# Altium schematic sheet FPGA_BANKS.SchDoc
size A4
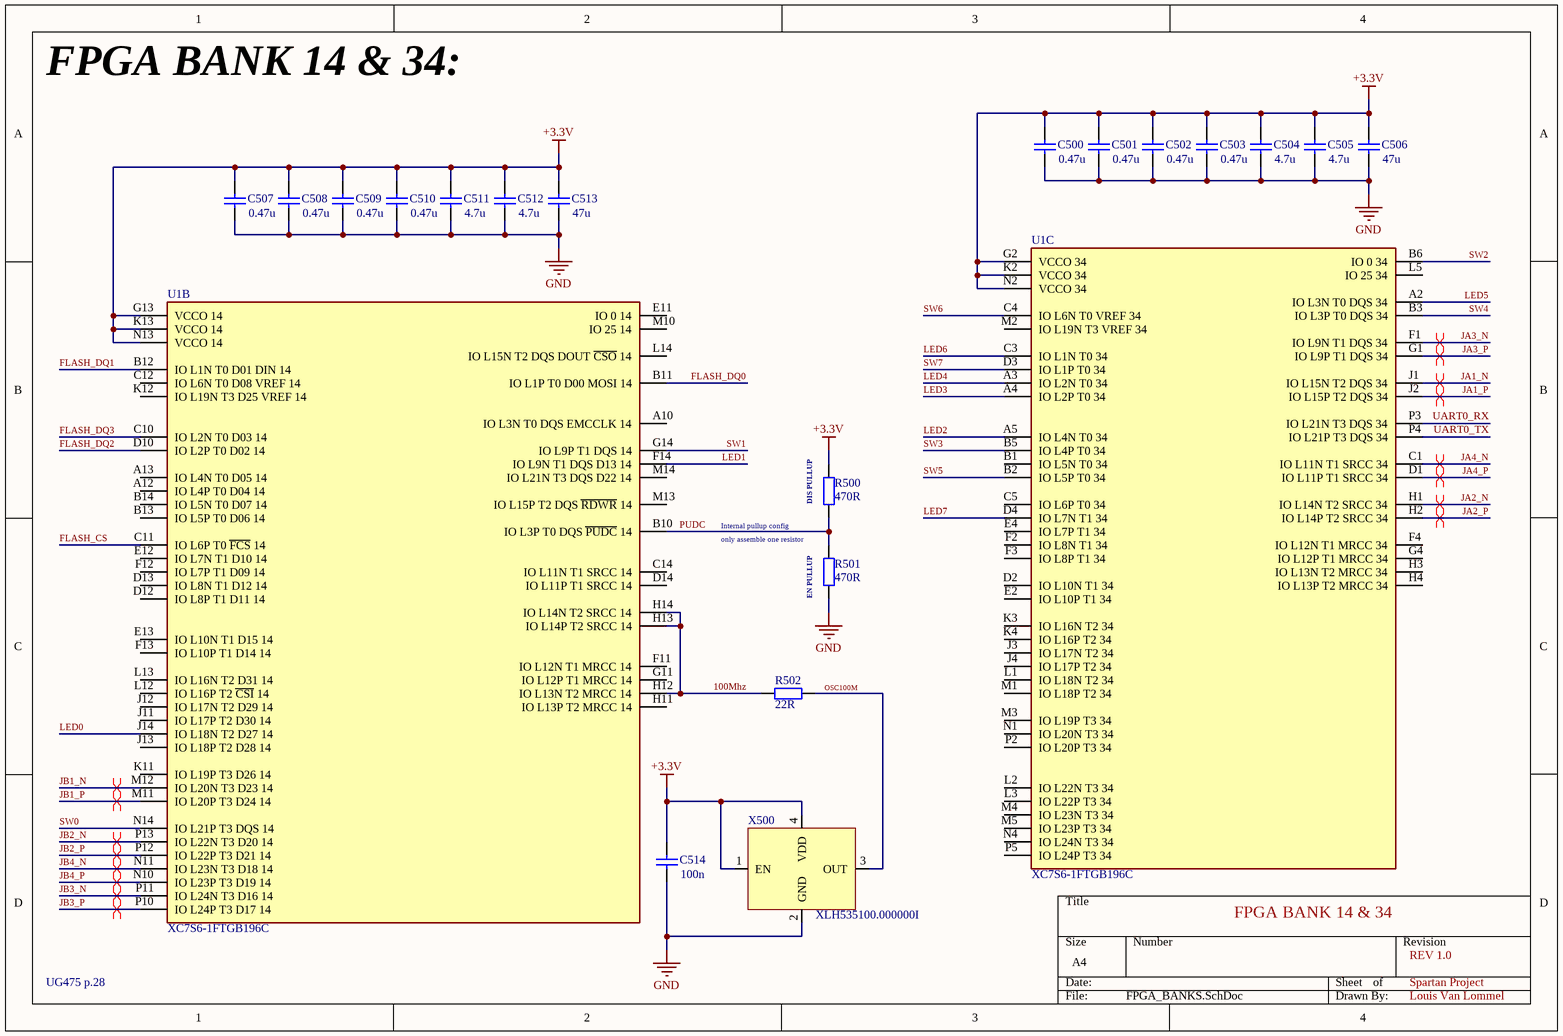
[diagram p0: FPGA_BANKS.SchDoc]

## Parts
C500  value 0.47u  [CAP_0402]  (hidden comment: 0.47uF)
C501  value 0.47u  [CAP_0402]  (hidden comment: 0.47uF)
C502  value 0.47u  [CAP_0402]  (hidden comment: 0.47uF)
C503  value 0.47u  [CAP_0402]  (hidden comment: 0.47uF)
C504  4.7u  [CAP_0402]
C505  4.7u  [CAP_0402]
C506  value 47u  [CAP_0603]  (hidden comment: 47uF)
C507  value 0.47u  [CAP_0402]  (hidden comment: 0.47uF)
C508  value 0.47u  [CAP_0402]  (hidden comment: 0.47uF)
C509  value 0.47u  [CAP_0402]  (hidden comment: 0.47uF)
C510  value 0.47u  [CAP_0402]  (hidden comment: 0.47uF)
C511  4.7u  [CAP_0402]
C512  4.7u  [CAP_0402]
C513  value 47u  [CAP_0603]  (hidden comment: 47uF)
C514  100n  [CAP_0603]
R500  value 470R  [RES_0603]  (hidden comment: 470)
R501  value 470R  [RES_0603]  (hidden comment: 470 DNP)
R502  value 22R  [RES_0603]  (hidden comment: 22)
U1  XC7S6-1FTGB196C  [FP-XC7S6-1FTGB196C-MFG]  (parts B,C of 4)
X500  XLH535100.000000I  [5X3.2MM CRYSTAL]

## Nets
+3.3V: C500.2 C501.2 C502.2 C503.2 C504.2 C505.2 C506.2 C507.2 C508.2 C509.2 C510.2 C511.2 C512.2 C513.2 C514.2 R500.2 U1.G2(VCCO_34) U1.G13(VCCO_14) U1.K2(VCCO_34) U1.K13(VCCO_14) U1.N2(VCCO_34) U1.N13(VCCO_14) X500.1(EN) X500.4(VDD)
GND: C500.1 C501.1 C502.1 C503.1 C504.1 C505.1 C506.1 C507.1 C508.1 C509.1 C510.1 C511.1 C512.1 C513.1 C514.1 R501.1 X500.2(GND)
100Mhz: R502.2 U1.H12(IO_L13N_T2_MRCC_14) U1.H13(IO_L14P_T2_SRCC_14) U1.H14(IO_L14N_T2_SRCC_14)
FLASH_CS: U1.C11(IO_L6P_T0_~{FCS}_14)
FLASH_DQ0: U1.B11(IO_L1P_T0_D00_MOSI_14)
FLASH_DQ1: U1.B12(IO_L1N_T0_D01_DIN_14)
FLASH_DQ2: U1.D10(IO_L2P_T0_D02_14)
FLASH_DQ3: U1.C10(IO_L2N_T0_D03_14)
JA1_N: U1.J1(IO_L15N_T2_DQS_34)
JA1_P: U1.J2(IO_L15P_T2_DQS_34)
JA2_N: U1.H1(IO_L14N_T2_SRCC_34)
JA2_P: U1.H2(IO_L14P_T2_SRCC_34)
JA3_N: U1.F1(IO_L9N_T1_DQS_34)
JA3_P: U1.G1(IO_L9P_T1_DQS_34)
JA4_N: U1.C1(IO_L11N_T1_SRCC_34)
JA4_P: U1.D1(IO_L11P_T1_SRCC_34)
JB1_N: U1.M12(IO_L20N_T3_D23_14)
JB1_P: U1.M11(IO_L20P_T3_D24_14)
JB2_N: U1.P13(IO_L22N_T3_D20_14)
JB2_P: U1.P12(IO_L22P_T3_D21_14)
JB3_N: U1.P11(IO_L24N_T3_D16_14)
JB3_P: U1.P10(IO_L24P_T3_D17_14)
JB4_N: U1.N11(IO_L23N_T3_D18_14)
JB4_P: U1.N10(IO_L23P_T3_D19_14)
LED0: U1.J14(IO_L18N_T2_D27_14)
LED1: U1.F14(IO_L9N_T1_DQS_D13_14)
LED2: U1.A5(IO_L4N_T0_34)
LED3: U1.A4(IO_L2P_T0_34)
LED4: U1.A3(IO_L2N_T0_34)
LED5: U1.A2(IO_L3N_T0_DQS_34)
LED6: U1.C3(IO_L1N_T0_34)
LED7: U1.D4(IO_L7N_T1_34)
OSC100M: R502.1 X500.3(OUT)
PUDC: R500.1 R501.2 U1.B10(IO_L3P_T0_DQS_~{PUDC}_14)
SW0: U1.N14(IO_L21P_T3_DQS_14)
SW1: U1.G14(IO_L9P_T1_DQS_14)
SW2: U1.B6(IO_0_34)
SW3: U1.B5(IO_L4P_T0_34)
SW4: U1.B3(IO_L3P_T0_DQS_34)
SW5: U1.B2(IO_L5P_T0_34)
SW6: U1.C4(IO_L6N_T0_VREF_34)
SW7: U1.D3(IO_L1P_T0_34)
UART0_RX: U1.P3(IO_L21N_T3_DQS_34)
UART0_TX: U1.P4(IO_L21P_T3_DQS_34)

Not connected (* = marked no-connect by the designer): U1 A10(IO_L3N_T0_DQS_EMCCLK_14) A12(IO_L4P_T0_D04_14) A13(IO_L4N_T0_D05_14) B1(IO_L5N_T0_34) B13(IO_L5P_T0_D06_14) B14(IO_L5N_T0_D07_14) C5(IO_L6P_T0_34) C12(IO_L6N_T0_D08_VREF_14) C14(IO_L11N_T1_SRCC_14) D2(IO_L10N_T1_34) D12(IO_L8P_T1_D11_14) D13(IO_L8N_T1_D12_14) D14(IO_L11P_T1_SRCC_14) E2(IO_L10P_T1_34) E4(IO_L7P_T1_34) E11(IO_0_14) E12(IO_L7N_T1_D10_14) E13(IO_L10N_T1_D15_14) F2(IO_L8N_T1_34) F3(IO_L8P_T1_34) F4(IO_L12N_T1_MRCC_34) F11(IO_L12N_T1_MRCC_14) F12(IO_L7P_T1_D09_14) F13(IO_L10P_T1_D14_14) G4(IO_L12P_T1_MRCC_34) G11(IO_L12P_T1_MRCC_14) H3(IO_L13N_T2_MRCC_34) H4(IO_L13P_T2_MRCC_34) H11(IO_L13P_T2_MRCC_14) J3(IO_L17N_T2_34) J4(IO_L17P_T2_34) J11(IO_L17P_T2_D30_14) J12(IO_L17N_T2_D29_14) J13(IO_L18P_T2_D28_14) K3(IO_L16N_T2_34) K4(IO_L16P_T2_34) K11(IO_L19P_T3_D26_14) K12(IO_L19N_T3_D25_VREF_14) L1(IO_L18N_T2_34) L2(IO_L22N_T3_34) L3(IO_L22P_T3_34) L5(IO_25_34) L12(IO_L16P_T2_~{CSI}_14) L13(IO_L16N_T2_D31_14) L14(IO_L15N_T2_DQS_DOUT_~{CSO}_14) M1(IO_L18P_T2_34) M2(IO_L19N_T3_VREF_34) M3(IO_L19P_T3_34) M4(IO_L23N_T3_34) M5(IO_L23P_T3_34) M10(IO_25_14) M13(IO_L15P_T2_DQS_~{RDWR}_14) M14(IO_L21N_T3_DQS_D22_14) N1(IO_L20N_T3_34) N4(IO_L24N_T3_34) P2(IO_L20P_T3_34) P5(IO_L24P_T3_34)

## Layout directives
differential pair: JA1_N, JA1_P, JA2_N, JA2_P, JA3_N, JA3_P, JA4_N, JA4_P, JB1_N, JB1_P, JB2_N, JB2_P, JB3_N, JB3_P, JB4_N, JB4_P

## Notes on the sheet
- FPGA BANK 14 & 34:
- (near R500) DIS PULLUP
- Internal pullup config
- (near R501) only assemble one resistor
- (near R501) EN PULLUP
- (near U1) FPGA BANK 14 & 34
- UG475 p.28
- REV 1.0
- Spartan Project
- Louis Van Lommel

## Library data of the parts
C500-C514 = Cap: Capacitor; Published: 8-Jun-2000; LatestRevisionDate: 17-Jul-2002; LatestRevisionNote: Re-released for DXP Platform.; PackageReference: RAD-0.3; Publisher: Altium Limited; PackageDescription: Radial Cap, Thru-Hole; 2 Leads; 0.3 in Pin Spacing
  C504 C505 C511 C512: Value: 4.7u
  C514: Value: 100n
R500 R502 = Res2: Resistor; Published: 8-Jun-2000; LatestRevisionDate: 17-Jul-2002; LatestRevisionNote: Re-released for DXP Platform.; PackageReference: AXIAL-0.4; Publisher: Altium Limited; PackageDescription: Axial Device, Thru-Hole; 2 Leads; 0.4 in Pin Spacing
R501 = Res2: Resistor Enable pullup BANK FPGA; Populated: DNP; Published: 8-Jun-2000; LatestRevisionDate: 17-Jul-2002; LatestRevisionNote: Re-released for DXP Platform.; PackageReference: AXIAL-0.4; Publisher: Altium Limited; PackageDescription: Axial Device, Thru-Hole; 2 Leads; 0.4 in Pin Spacing
U1 = CMP-17530-000008-1: Manufacturer: Xilinx; Standoff Height: 0.3mm; Max Supply Voltage: 3.465V; Number Of Logic Elements Cells: 6000; Number Of I/Os: 100; Min Supply Voltage: 0.95V; Ram Size: 180Kbits; Frequency: 200MHz; Max Junction Temp: +85°C; Speed Grade: 1; Propagation Delay: 0.13ns; Number Of Logic Blocks: 938; Lead Free: Yes; Device Class L1: Integrated Circuits (ICs); Category: IC; Ipc Land Pattern Name: BGA196C100P14X14_1500X1500X146; Manufacturer Part Number: XC7S6-1FTGB196C; Temperature Range High: +85°C; ComponentLink2Description: Datasheet; Package: XC7S6-1FTGB196C; Height: 1.55mm; Device Class L2: Embedded Processors and Controllers; Digikey Description: XC7S6-1FTGB196C; Temperature: 0°C to +85°C; Device Class L3: FPGAs - Field Programmable Gate Arrays; Automotive: No; Octopart: https://octopart.com/xc7s6-1ftgb196c-xilinx-81890684; Footprint Url: https://www.xilinx.com/support/documentation/user_guides/ug475_7Series_Pkg_Pinout.pdf; ComponentLink2URL: https://www.xilinx.com/support/documentation/data_sheets/ds189-spartan-7-data-sheet.pdf; RoHS: TRUE; Temperature Range Low: 0°C
X500 = Oscillator: 12Mhz oscillator